# EAGLE design 16*Vibrationdriver_PCA9685 (EAGLE 7.2.0)
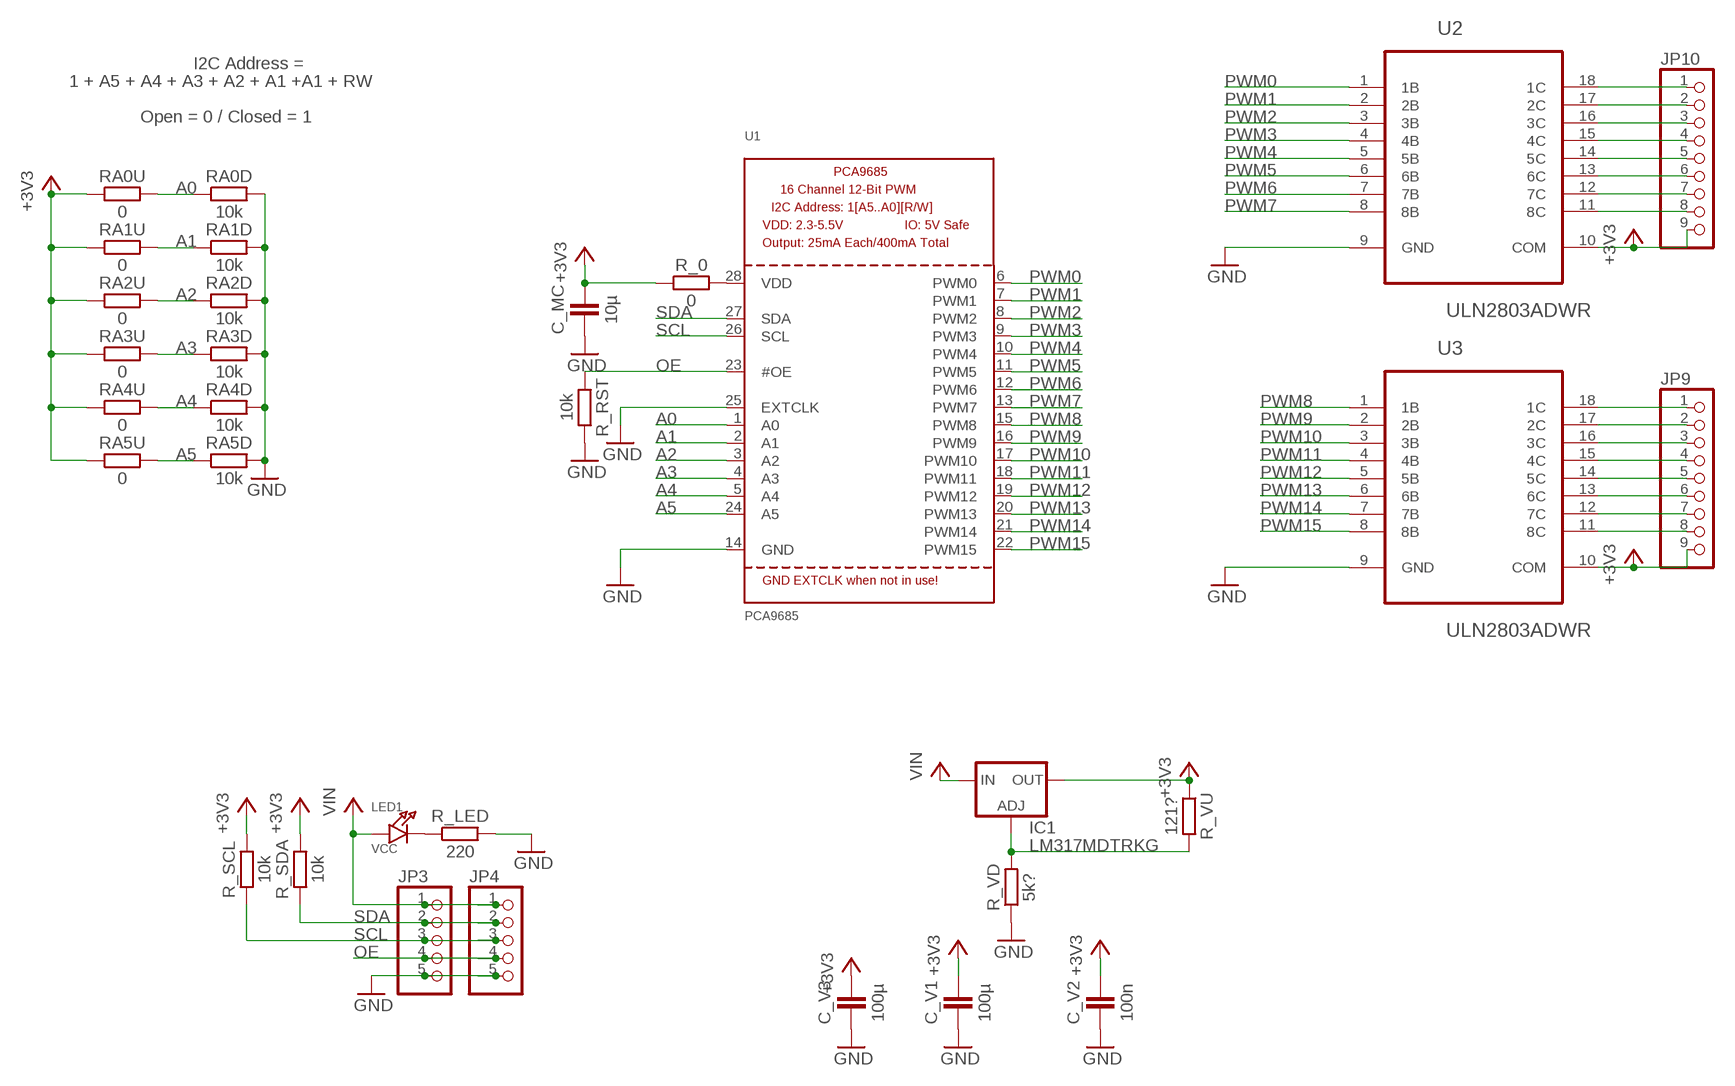
[diagram p0: schematic, sheet 1]

## Parts
C_MC  10µ  CAPACITOR  [603]
C_V1  100µ  CAPACITOR1206  [1206]
C_V2  100n  CAPACITOR  [603]
C_V3  100µ  CAPACITOR1206  [1206]
IC1  LM317MDTRKG  [DPACK]
JP3  PINHD-1X5  [1X05]
JP4  PINHD-1X5  [1X05]
JP9  PINHD-1X9  [1X09]
JP10  PINHD-1X9  [1X09]
LED1  VCC  LED0805  [CHIPLED_0805]
R_0  0  RESISTOR0603  [603]
R_LED  220  RESISTOR0603  [603]
R_RST  10k  RESISTOR0603  [603]
R_SCL  10k  RESISTOR0603  [603]
R_SDA  10k  RESISTOR0603  [603]
R_VD  5k?  RESISTOR0603  [603]
R_VU  121?  RESISTOR0603  [603]
RA0D  10k  RESISTOR0603  [603]
RA0U  0  RESISTOR0603  [603]
RA1D  10k  RESISTOR0603  [603]
RA1U  0  RESISTOR0603  [603]
RA2D  10k  RESISTOR0603  [603]
RA2U  0  RESISTOR0603  [603]
RA3D  10k  RESISTOR0603  [603]
RA3U  0  RESISTOR0603  [603]
RA4D  10k  RESISTOR0603  [603]
RA4U  0  RESISTOR0603  [603]
RA5D  10k  RESISTOR0603  [603]
RA5U  0  RESISTOR0603  [603]
U1  PCA9685  [TSSOP28]
U2  ULN2803ADWR  [SOIC127P1030X265-18N]
U3  ULN2803ADWR  [SOIC127P1030X265-18N]

## Nets
+3V3: C_MC.2 C_V1.2 C_V2.2 C_V3.2 IC1.4(OUT) JP9.9 JP10.9 R_0.1 R_SCL.2 R_SDA.2 R_VU.1 RA0U.1 RA1U.1 RA2U.1 RA3U.1 RA4U.1 RA5U.1 U2.10(COM) U3.10(COM)
A0: RA0D.1 RA0U.2 U1.1(A0)
A1: RA1D.1 RA1U.2 U1.2(A1)
A2: RA2D.1 RA2U.2 U1.3(A2)
A3: RA3D.1 RA3U.2 U1.4(A3)
A4: RA4D.1 RA4U.2 U1.5(A4)
A5: RA5D.1 RA5U.2 U1.24(A5)
GND: C_MC.1 C_V1.1 C_V2.1 C_V3.1 JP3.5 JP4.5 R_LED.2 R_RST.2 R_VD.1 RA0D.2 RA1D.2 RA2D.2 RA3D.2 RA4D.2 RA5D.2 U1.14(GND) U1.25(EXTCLK) U2.9(GND) U3.9(GND)
N$1: LED1.C R_LED.1
N$2: R_0.2 U1.28(VDD)
N$14: JP10.1 U2.18(1C)
N$18: IC1.1(ADJ) R_VD.2 R_VU.2
N$19: JP10.2 U2.17(2C)
N$20: JP10.3 U2.16(3C)
N$21: JP10.4 U2.15(4C)
N$22: JP10.5 U2.14(5C)
N$23: JP10.6 U2.13(6C)
N$24: JP10.7 U2.12(7C)
N$25: JP10.8 U2.11(8C)
N$26: JP9.1 U3.18(1C)
N$27: JP9.2 U3.17(2C)
N$28: JP9.3 U3.16(3C)
N$29: JP9.4 U3.15(4C)
N$30: JP9.5 U3.14(5C)
N$31: JP9.6 U3.13(6C)
N$32: JP9.7 U3.12(7C)
N$33: JP9.8 U3.11(8C)
OE: JP3.4 JP4.4 R_RST.1 U1.23(#OE)
PWM0: U1.6(PWM0) U2.1(1B)
PWM1: U1.7(PWM1) U2.2(2B)
PWM2: U1.8(PWM2) U2.3(3B)
PWM3: U1.9(PWM3) U2.4(4B)
PWM4: U1.10(PWM4) U2.5(5B)
PWM5: U1.11(PWM5) U2.6(6B)
PWM6: U1.12(PWM6) U2.7(7B)
PWM7: U1.13(PWM7) U2.8(8B)
PWM8: U1.15(PWM8) U3.1(1B)
PWM9: U1.16(PWM9) U3.2(2B)
PWM10: U1.17(PWM10) U3.3(3B)
PWM11: U1.18(PWM11) U3.4(4B)
PWM12: U1.19(PWM12) U3.5(5B)
PWM13: U1.20(PWM13) U3.6(6B)
PWM14: U1.21(PWM14) U3.7(7B)
PWM15: U1.22(PWM15) U3.8(8B)
SCL: JP3.3 JP4.3 R_SCL.1 U1.26(SCL)
SDA: JP3.2 JP4.2 R_SDA.1 U1.27(SDA)
VCC: IC1.3(IN) JP3.1 JP4.1 LED1.A ; supply symbol labelled VIN

## Notes on the sheet
- I2C Address =
- 1 + A5 + A4 + A3 + A2 + A1 +A1 + RW
- Open = 0 / Closed = 1

## Library data of the parts
C_MC C_V1-C_V3 = thar:CAPACITOR
IC1 = v-reg:LM317?*: 500 mA Adjustable Output Positive Voltage Regulator Source: http://www.onsemi.co.jp .. LM317M-D.PDF
JP3 JP4 = pinhead:PINHD-1X5: PIN HEADER
JP9 JP10 = pinhead:PINHD-1X9: PIN HEADER
LED1 = microbuilder:LED: LED 0603 - 0603 Surface Mount Package 2mA: Green LED - Low Power (3.9mcd, 2ma, 1.7Vf) - Digikey: 475-2709-2-ND Orange LED - Low Power (9.8mcd, 2ma, 1.8Vf) - Digikey: 475-1194-2-ND Red LED - Low Power (5mcd, 2ma, 1.8Vf) - Digikey: 475-1195-2-ND Yellow LED - Low Power (7mcd, 2ma, 1.8Vf) - Digikey: 475-1196-2-ND 5mA: Blue LED - Low Power (17mcd, 5ma, 2.9Vf) - Digikey: LNJ937W8CRACT-ND 0805 - 0805 Surface Mount Package 2mA: Red LED (8.8mcd, 2mA, 1.8Vf, Clear) - Low Power [Digikey: 475-2510-1-ND] Green LED (5mcd, 2mA, 1.8Vf, Clear) - Low Power [Digikey: 475-2730-1-ND] Yellow LED (11.3mcd, 2mA, 1.8Vf, Clear) - Low Power [Digikey: 475-2555-1-ND] 20mA: Red LED (104mcd, 20mA, Diffused) - LS R976 [Digikey: 475-1278-6-ND] Red LED (12mcd, 20mA, 2.0Vf, Clear) - APT2012EC [Digikey: 754-1128-1-ND] Green LED (15mcd, 20mA, 2.2Vf, Clear) - APT2012GC [Digikey: 754-1131-1-ND] Orange LED (160mcd, 20mA, 2.1Vf, Clear) - APT2012SECK [Digikey: 754-1130-1-ND] 1206 - 1206 Surface Mount Package Green LED (26mcd, 20mA, Diffused) - LG N971 [Digikey: 475-1407-6-ND] Red LED (15mcd, 20mA, Diffused) - LH N974 [Digikey: 475-1416-6-ND]
R_0 R_LED R_RST R_SCL R_SDA R_VD R_VU RA0D RA0U RA1D RA1U RA2D RA2U RA3D RA3U RA4D RA4U RA5D RA5U = thar:RESISTOR
U1 = microbuilder:PCA9685: PCA9685 - 16 Channel 12-Bit I2C PWM Controller 5.0V tolerant 16 channel, 12-bit I2C PWM controller with 25mA per output (max. 400mA total) Digikey: 568-5931-1-ND
U2 U3 = TI_ULN2803:ULN2803ADWR: Darlington transistor array; MPN: ULN2803ADWR; OC_FARNELL: 1652420; OC_NEWARK: 87H4769; PACKAGE: SOIC-18; SUPPLIER: TEXAS INSTRUMENTS

## Board
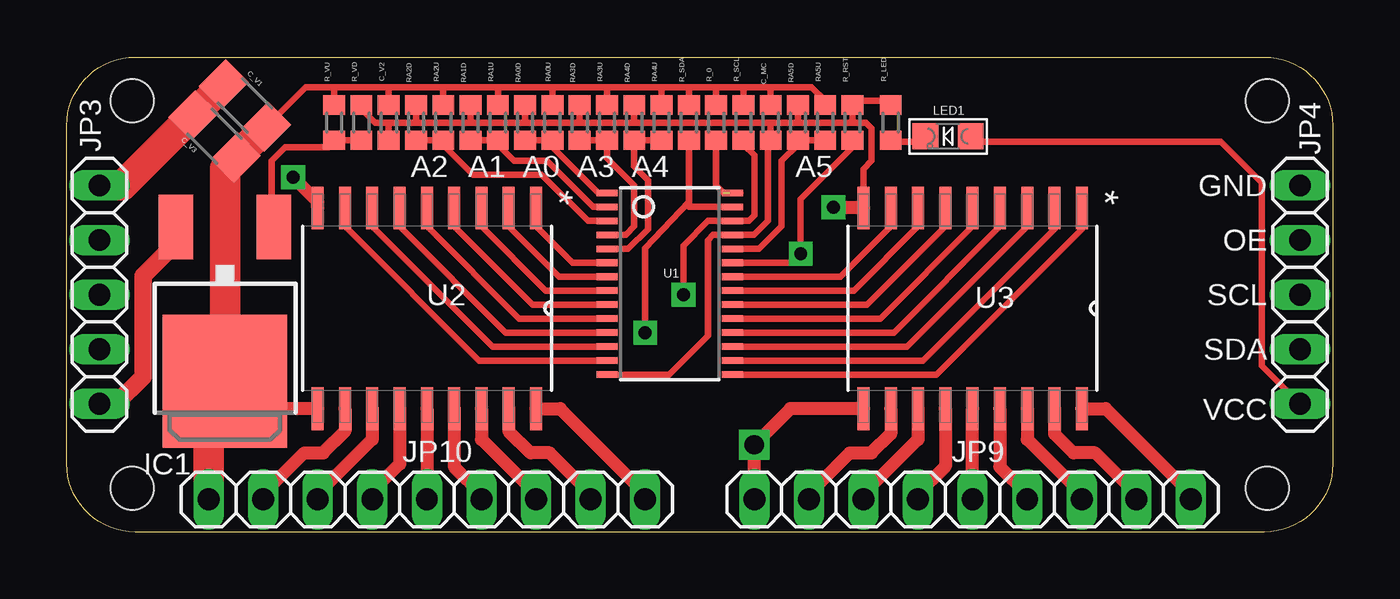
[diagram p1: board, top side]
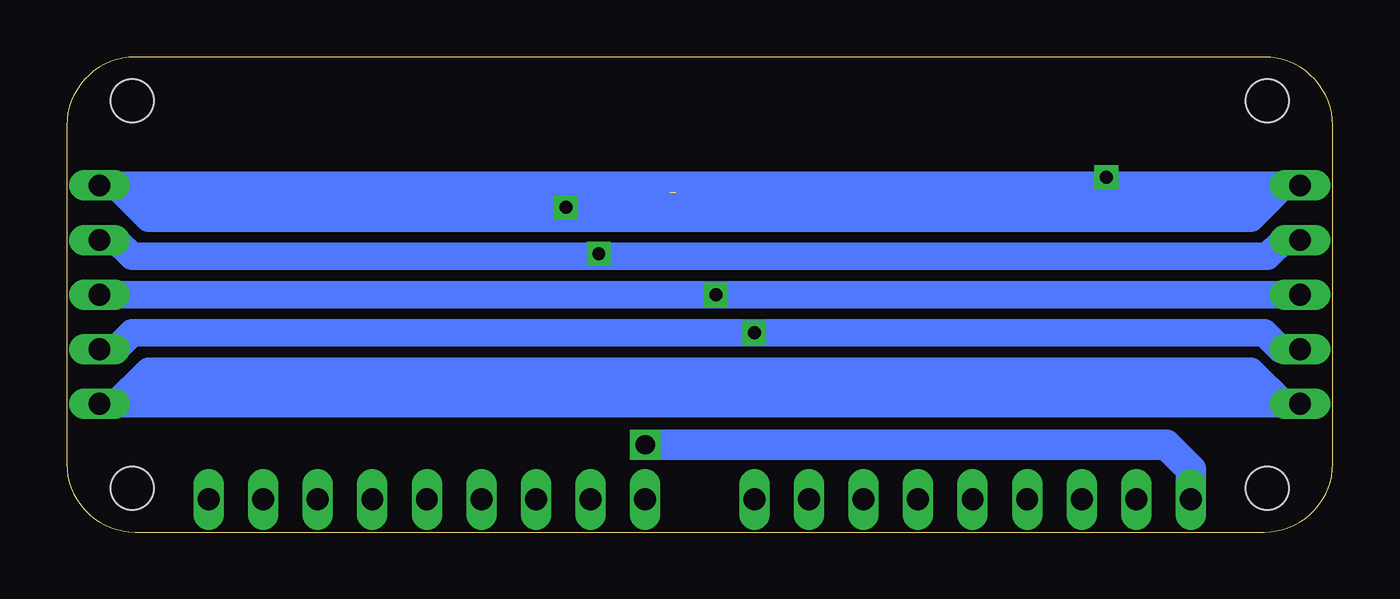
[diagram p2: board, bottom side, seen from below]

Size 58.93 x 22.1 mm. Coordinates in mm from the lower left corner, seen from the top.
Outline: 3.17,0 arc-90 0,3.17 0,18.92 arc-90 3.17,22.1 55.75,22.1 arc-90 58.93,18.92 58.93,3.17 arc-90 55.75,0 3.17,0
Copper layers (1*16): Top 0.035mm / dielectric 1.5mm / Bottom 0.035mm
Design rules "PCBCart-Standard": minimum track width 8mil, minimum drill 0.4mm, track to track 8mil, track to pad 8mil, pad to pad 8mil, via to via 8mil, smd to smd 8mil, copper to edge 20mil, drill to drill 8mil, minimum pad ring 8mil, minimum via ring 10mil, stop-mask expansion 3mil, vias tented up to drill 20mil, thermal gap 8mil
Holes 2 mm at 3.05,20.07 55.88,20.07 55.88,2.03 3.05,2.03

### Footprints (pad centres in the part's own frame; a part is rotated, then mirrored left to right if it is on the bottom)
603 = smd 0.889 x 1.016: 1 -0.826,0; 2 0.826,0
1206 = smd 1.524 x 1.778: 1 -1.397,0; 2 1.397,0
DPACK = smd 1.6 x 3: 1 -2.28,-4.8; 3 2.28,-4.8 | smd 5.8 x 6.2: 4 0,2.38
1X05 = drill 1.016 long: 1 -5.08,0; 2 -2.54,0; 3 0,0; 4 2.54,0; 5 5.08,0
1X09 = drill 1.016 long: 1 -10.16,0; 2 -7.62,0; 3 -5.08,0; 4 -2.54,0; 5 0,0; 6 2.54,0; 7 5.08,0; 8 7.62,0; 9 10.16,0
CHIPLED_0805 = smd 1.2 x 1.2: A 0,-1.05; C 0,1.05
TSSOP28 = smd 0.305 x 0.991: 1 -4.225,-2.918; 2 -3.575,-2.918; 3 -2.925,-2.918; 4 -2.275,-2.918; 5 -1.625,-2.918; 6 -0.975,-2.918; 7 -0.325,-2.918; 8 0.325,-2.918; 9 0.975,-2.918; 10 1.625,-2.918; 11 2.275,-2.918; 12 2.925,-2.918; 13 3.575,-2.918; 14 4.225,-2.918; 15 4.225,2.918; 16 3.575,2.918; 17 2.925,2.918; 18 2.275,2.918; 19 1.625,2.918; 20 0.975,2.918; 21 0.325,2.918; 22 -0.325,2.918; 23 -0.975,2.918; 24 -1.625,2.918; 25 -2.275,2.918; 26 -2.925,2.918; 27 -3.575,2.918; 28 -4.225,2.918
SOIC127P1030X265-18N = smd 1.981 x 0.559: 1 -4.674,5.08; 2 -4.674,3.81; 3 -4.674,2.54; 4 -4.674,1.27; 5 -4.674,0; 6 -4.674,-1.27; 7 -4.674,-2.54; 8 -4.674,-3.81; 9 -4.674,-5.08; 10 4.674,-5.08; 11 4.674,-3.81; 12 4.674,-2.54; 13 4.674,-1.27; 14 4.674,0; 15 4.674,1.27; 16 4.674,2.54; 17 4.674,3.81; 18 4.674,5.08

### Placement (x,y rotation side)
C_MC  32.77,19.05 90 top
C_V1  8.29,19.85 315 top
C_V2  14.99,19.05 90 top
C_V3  6.88,18.41 315 top
IC1  7.37,9.4 180 top
JP3  1.52,11.05 90 top
JP4  57.4,11.05 90 top
JP9  42.16,1.52 180 top
JP10  16.76,1.52 180 top
LED1  41.02,18.41 90 top
R_0  30.23,19.05 270 top
R_LED  38.35,19.05 90 top
R_RST  36.58,19.05 90 top
R_SCL  31.5,19.05 90 top
R_SDA  28.96,19.05 90 top
R_VD  13.72,19.05 270 top
R_VU  12.45,19.05 270 top
RA0D  21.34,19.05 90 top
RA0U  22.61,19.05 270 top
RA1D  18.8,19.05 90 top
RA1U  20.07,19.05 270 top
RA2D  16.26,19.05 90 top
RA2U  17.53,19.05 270 top
RA3D  23.88,19.05 90 top
RA3U  25.15,19.05 270 top
RA4D  26.42,19.05 90 top
RA4U  27.69,19.05 270 top
RA5D  34.04,19.05 90 top
RA5U  35.31,19.05 270 top
U1  28.07,11.56 270 top
U2  16.76,10.41 270 top
U3  42.16,10.41 270 top

### Tracks (layer width: path | path; a pad name or v marks a point on that pad's centre or on a via)
+3V3  (via drill 0.9)
  Top 0.305: 37.06,5.71 U3.10 | 17.53,20.7 20.07,20.7 | 20.07,20.7 22.61,20.7 | 22.61,20.7 25.15,20.7 | 25.15,20.7 27.69,20.7 | 27.69,20.7 28.96,20.7 | 28.96,20.7 30.23,20.7 | 30.23,20.7 31.5,20.7 | 31.5,20.7 32.77,20.7 | C_MC.2 32.77,20.7 | R_SCL.2 31.5,20.7 | R_0.1 30.23,20.7 | R_SDA.2 28.96,20.7 | RA3U.1 25.15,20.7 | RA0U.1 22.61,20.7 | RA4U.1 27.69,20.7 | RA2U.1 17.53,20.7 | RA1U.1 20.07,20.7 | RA5U.1 35.31,20.07 34.67,20.7 32.77,20.7 | 14.99,20.7 17.53,20.7 | C_V2.2 14.99,20.7 | 14.99,20.7 12.45,20.7 | R_VU.1 12.45,20.7 | 12.45,20.7 11.12,20.7 C_V1.2
  Top 0.61: JP10.9 6.6,1.78 | JP9.9 v32,4.06 33.68,5.74 U3.10 | U2.10 6.76,5.74 6.6,5.59
  Top 1.27: IC1.4 6.95,7.27 6.86,8.13 6.86,6.86 7.11,7.11
  Top 1.422: 7.11,7.11 6.6,5.59 JP10.9 | C_V1.2 8.3,17.86 | 8.3,17.86 C_V3.2 | IC1.4 7.37,16.93 8.3,17.86
  Bottom 1.422: v32,4.06 7.75,4.06 6.6,2.92 JP10.9
A0
  Top 0.305: U1.1 24.73,15.78 22.61,17.91 RA0U.2 | RA0U.2 RA0D.1 | RA0U.2 22.8,18.22 22.86,18.16
A1
  Top 0.305: U1.2 24.49,15.13 22.35,17.27 20.83,17.27 20.07,18.03 RA1U.2 RA1D.1
A2
  Top 0.305: U1.3 24.25,14.48 22.1,16.64 18.92,16.64 17.53,18.03 RA2U.2 RA2D.1
A3
  Top 0.305: RA3U.2 RA3D.1 | U1.4 26.02,13.83 26.42,14.22 26.42,16.13 25.15,17.4 RA3U.2 | 24.89,18.22 RA3U.2
A4
  Top 0.305: U1.5 26.14,13.18 27.05,14.1 27.05,16.38 26.42,17.02 RA4D.1 RA4U.2
A5
  Top 0.305: U1.24 32.23,13.18 33.27,14.22 33.27,17.27 34.04,18.03 RA5D.1 RA5U.2
GND  (via drill 0.6)
  Top 0.305: 18.8,19.05 21.34,19.05 | 21.34,19.05 23.88,19.05 | 23.88,19.05 26.42,19.05 | 32.77,19.05 26.42,19.05 | 36.7,20.07 36.58,20.07 36.58,19.05 | R_LED.2 38.35,20.07 36.7,20.07 | 36.7,20.07 R_RST.2 | 32.77,19.05 34.04,19.05 | 34.04,19.05 36.58,19.05 | 27.24,7.33 U1.14 28.03,7.33 29.84,9.14 29.84,13.59 30.09,13.83 U1.25 31.99,13.83 32.64,14.48 32.64,18.29 32.58,18.22 C_MC.1 32.77,19.05 | RA5D.2 34.04,19.05 | RA4D.2 26.42,19.05 | RA1D.2 18.8,19.05 | RA2D.2 16.26,19.05 | 16.26,19.05 18.8,19.05 | RA0D.2 21.34,19.05 | RA3D.2 23.88,19.05 | 36.58,19.05 37.21,19.05 37.47,18.8 37.47,17.27 37.08,16.89 U3.9 | C_V2.1 14.99,19.05 | 14.99,19.05 16.26,19.05 | 14.99,19.05 14.35,19.05 13.72,19.68 13.78,19.88 R_VD.1
  Top 0.61: v35.69,15.11 37.06,15.11 U3.9 | U2.9 11.68,15.37 v10.54,16.51
  Top 1.422: JP3.5 2.6,16.13 5.89,19.43 | 5.89,19.43 C_V1.1 | C_V3.1 5.89,19.43
  Bottom 0.305: v10.54,16.51 11.68,15.62 | 11.68,15.37 11.81,14.61
  Bottom 0.61: 39.88,16.38 40.39,16.13 | 36.7,15.37 36.58,15.49 38.23,16.13 | v35.69,15.11 36.83,15.24 36.7,15.37 | 36.7,15.37 11.68,15.37
  Bottom 1.27: JP3.5 2.29,16.13 3.81,14.61 11.81,14.61 36.7,14.61 | 36.7,15.37 36.7,14.61 | 36.7,14.61 55.12,14.61 56.64,16.13 JP4.5 | 1.4,16.13 40.39,16.13 JP4.5 | JP4.5 55.88,16.13 55.12,15.37 37.08,15.49 38.23,16.13 | 11.68,15.37 11.68,15.62 3.94,15.37 3.81,15.49
N$1
  Top 0.305: R_LED.1 38.42,18.22 38.35,18.16 39.72,18.16 LED1.C
N$2  (1 unrouted)
  Top 0.305: 30.86,15.78 U1.28 | 29.84,18.16 30.16,18.35 R_0.2 30.23,16.13 30.57,15.79 31.37,15.79
N$14
  Top 0.61: JP10.1 26.92,1.78 22.96,5.74 U2.18
N$18
  Top 0.305: IC1.1 9.91,14.2 10.16,14.59 9.52,14.59 9.52,17.27 10.16,17.91 12.19,17.91 12.57,18.16 12.45,18.16 R_VU.2 | R_VD.2 R_VU.2 | R_VU.2 12.38,18.22 | 12.19,18.22 12.38,18.22 | 12.38,18.22 12.45,18.29 R_VU.2
N$19
  Top 0.61: JP10.2 24.38,1.78 22.48,3.68 21.59,3.68 20.57,4.7 U2.17
N$20
  Top 0.61: JP10.3 21.84,1.78 19.3,4.32 U2.16
N$21
  Top 0.61: JP10.4 19.3,1.78 18.03,3.05 U2.15
N$22
  Top 0.61: U2.14 JP10.5
N$23
  Top 0.61: JP10.6 14.22,1.91 15.49,3.17 U2.13
N$24
  Top 0.61: JP10.7 11.68,1.78 14.22,4.32 U2.12
N$25
  Top 0.61: JP10.8 9.14,1.78 11.05,3.68 11.94,3.68 12.95,4.7 U2.11
N$26
  Top 0.61: JP9.1 52.32,1.78 48.36,5.74 U3.18
N$27
  Top 0.61: JP9.2 49.78,1.78 47.88,3.68 46.86,3.68 45.97,4.57 U3.17
N$28
  Top 0.61: JP9.3 47.24,1.78 44.7,4.32 U3.16
N$29
  Top 0.61: JP9.4 44.7,1.78 43.43,3.05 U3.15
N$30
  Top 0.61: JP9.5 U3.14
N$31
  Top 0.61: JP9.6 39.62,1.78 40.89,3.05 U3.13
N$32
  Top 0.61: JP9.7 37.08,1.78 39.62,4.32 U3.12
N$33
  Top 0.61: JP9.8 34.54,1.78 36.45,3.68 37.47,3.68 38.35,4.57 U3.11
OE  (via drill 0.6)
  Top 0.305: U1.23 34.12,12.53 v34.16,12.95 | R_RST.1 36.58,17.91 34.16,15.49 v34.16,12.95 | v34.16,12.95 34.16,12.83 34.29,12.83 v34.16,12.95
  Bottom 0.305: 55.88,12.83 34.29,12.83 v34.16,12.95
  Bottom 1.27: JP3.4 2.29,13.59 3.05,12.83 55.88,12.83 56.64,13.59 JP4.4
PWM0
  Top 0.305: U1.6 23.54,12.53 21.84,14.22 U2.1
PWM1
  Top 0.305: U1.7 22.92,11.88 20.57,14.22 U2.2
PWM2
  Top 0.305: U1.8 22.3,11.23 19.3,14.22 U2.3
PWM3
  Top 0.305: U1.9 21.68,10.58 18.03,14.22 U2.4
PWM4
  Top 0.305: U1.10 21.06,9.93 16.76,14.22 U2.5
PWM5
  Top 0.305: U1.11 20.44,9.28 15.49,14.22 U2.6
PWM6
  Top 0.305: U1.12 19.82,8.63 14.22,14.22 U2.7
PWM7
  Top 0.305: U1.13 19.2,7.98 12.95,14.22 U2.8
PWM8
  Top 0.305: U3.1 47.24,14.1 40.48,7.33 U1.15
PWM9
  Top 0.305: U3.2 45.97,14.1 39.86,7.98 U1.16
PWM10
  Top 0.305: U3.3 44.7,14.22 39.11,8.63 U1.17
PWM11
  Top 0.305: U3.4 43.43,14.22 38.49,9.28 U1.18
PWM12
  Top 0.305: U1.19 37.87,9.93 42.16,14.22 U3.5
PWM13
  Top 0.305: U1.20 37.25,10.58 40.89,14.22 U3.6
PWM14
  Top 0.305: U1.21 36.63,11.23 39.62,14.22 U3.7
PWM15
  Top 0.305: U1.22 36.01,11.88 38.35,14.22 U3.8
SCL  (via drill 0.6)
  Top 0.305: v28.7,11.05 28.7,13.34 29.85,14.48 U1.26 31.75,14.48 32,14.73 32,17.53 31.5,18.03 31.5,18.16 31.37,18.29 | R_SCL.1 31.56,18.22 31.56,18.29 31.37,18.29 | 31.24,18.29 31.37,18.29
  Bottom 1.27: JP3.3 v28.7,11.05 JP4.3
SDA  (via drill 0.6)
  Top 0.305: 28.96,15.37 28.98,15.13 U1.27 | 28.96,15.37 26.92,13.21 v26.92,9.27 | R_SDA.1 28.96,15.37
  Bottom 1.27: JP4.2 56.64,8.51 55.88,9.27 v26.92,9.27 3.17,9.27 2.41,8.51 JP3.2
VCC
  Top 0.305: JP4.1 57.28,5.97 57.28,6.1 55.63,7.75 55.63,16.26 53.72,18.16 42.04,18.16 42.07,18.2 LED1.A
  Top 0.813: IC1.3 5.09,13.47 3.56,11.94 3.56,7.24 2.29,5.97 JP3.1
  Bottom 1.27: JP4.1 56.64,5.97 55.12,7.49 3.81,7.49 2.29,5.97 JP3.1 JP4.1 | JP4.1 55.75,5.97 54.86,6.86 3.94,6.86 3.81,6.73

### Text on the board
tPlace: A2 | A1 | A0 | A3 | A4 | A5 | GND | OE | SCL | SDA | VCC